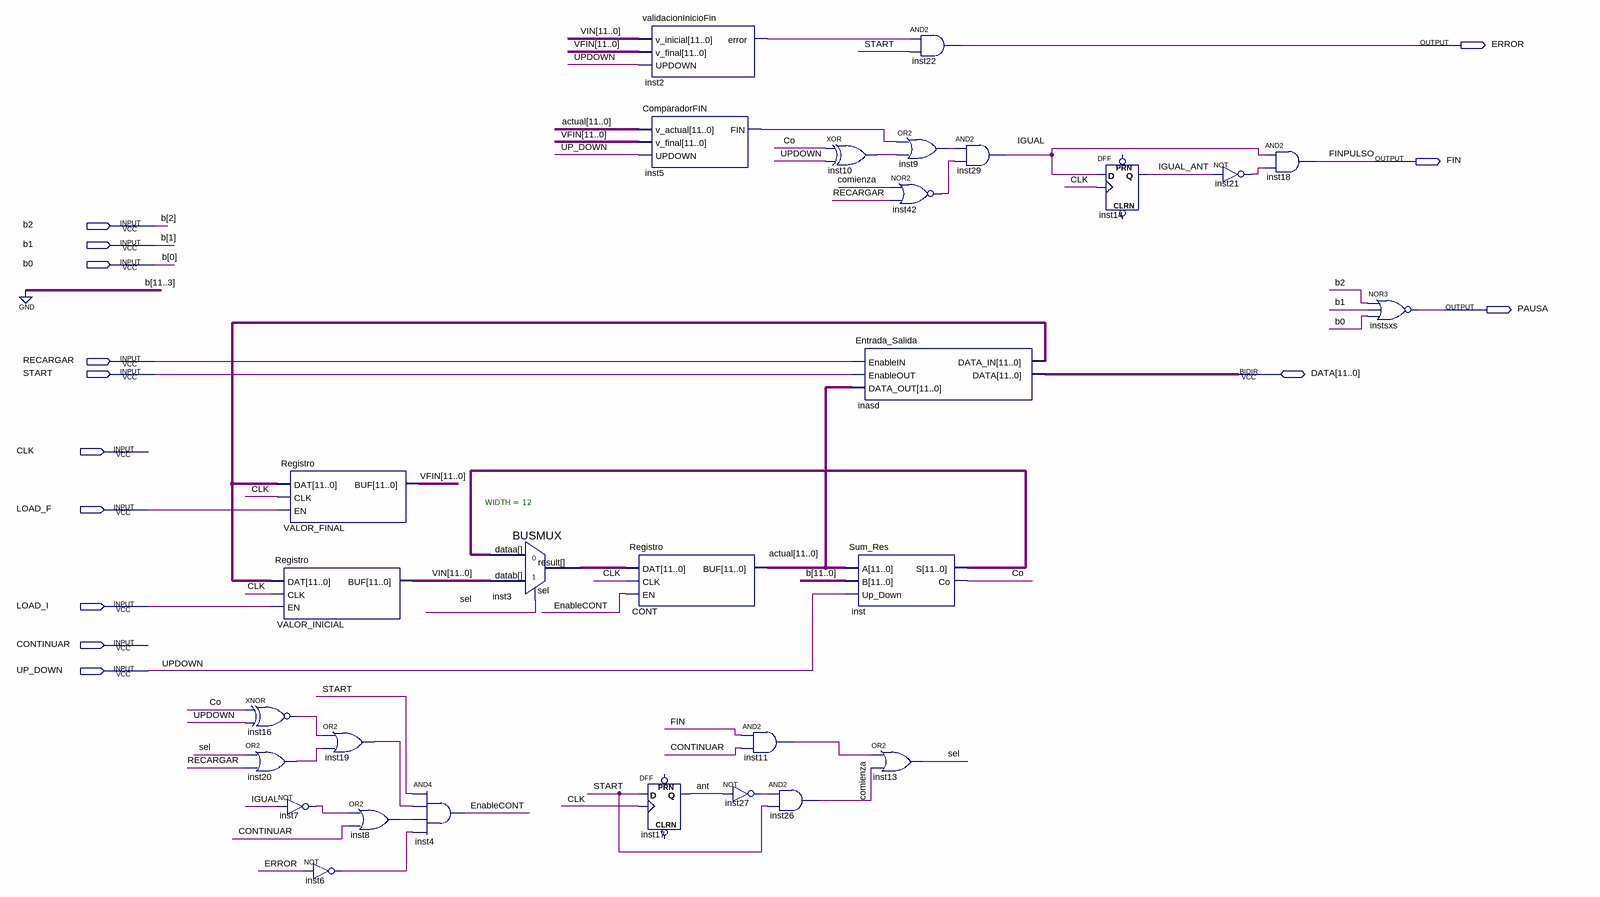
[diagram p0: schematic sheet]
// Quartus schematic CONTADOR_UPDOWN.bdf as structural Verilog: 29 symbols, 14 pins
module CONTADOR_UPDOWN (
  input  b2,
  input  b1,
  input  b0,
  input  RECARGAR,
  input  START,
  input  CLK,
  input  LOAD_F,
  input  LOAD_I,
  input  CONTINUAR,
  input  UP_DOWN,
  inout  [11:0] DATA,
  output ERROR,
  output FIN,
  output PAUSA
);

  wire ant, Co, comienza, EnableCONT, IGUAL, IGUAL_ANT, inst2_error, inst5_fin, inst6_out, inst7_out,
       inst8_out, inst9_out, inst10_out, inst11_out, inst16_out, inst19_out, inst20_out, inst21_out,
       inst27_out, inst42_out, sel;
  wire [11:0] actual, inasd_data_in, inst3_result, inst_s, VFIN, VIN;

  Registro VALOR_FINAL (.DAT(inasd_data_in), .CLK(CLK), .EN(LOAD_F), .BUF(VFIN));
  Registro VALOR_INICIAL (.DAT(inasd_data_in), .CLK(CLK), .EN(LOAD_I), .BUF(VIN));
  xnor inst16 (inst16_out, Co, UP_DOWN);
  or inst20 (inst20_out, sel, RECARGAR);
  not inst7 (inst7_out, IGUAL);
  or inst19 (inst19_out, inst16_out, inst20_out);
  not inst6 (inst6_out, ERROR);
  or inst8 (inst8_out, inst7_out, CONTINUAR);
  and inst4 (EnableCONT, START, inst19_out, inst8_out, inst6_out);
  BUSMUX #(.WIDTH(12)) inst3 (.datab(VIN), .sel(sel), .dataa(inst_s), .result(inst3_result));
  validacionInicioFin inst2 (.v_inicial(VIN), .v_final(VFIN), .UPDOWN(UP_DOWN), .error(inst2_error));
  ComparadorFIN inst5 (.v_actual(actual), .v_final(VFIN), .UPDOWN(UP_DOWN), .FIN(inst5_fin));
  Registro CONT (.DAT(inst3_result), .CLK(CLK), .EN(EnableCONT), .BUF(actual));
  DFF inst17 (.CLK(CLK), .D(START), .Q(ant));  // open: CLRN, PRN
  and inst11 (inst11_out, FIN, CONTINUAR);
  not inst27 (inst27_out, ant);
  and inst26 (comienza, inst27_out, START);
  xor inst10 (inst10_out, Co, UP_DOWN);
  Entrada_Salida inasd (
    .EnableIN(RECARGAR), .EnableOUT(START), .DATA_OUT(actual), .DATA_IN(inasd_data_in), .DATA(DATA));
  Sum_Res inst (.A(actual), .B({{9{1'b0}}, b2, b1, b0}), .Up_Down(UP_DOWN), .S(inst_s), .Co(Co));
  and inst22 (ERROR, inst2_error, START);
  or inst9 (inst9_out, inst5_fin, inst10_out);
  nor inst42 (inst42_out, comienza, RECARGAR);
  or inst13 (sel, inst11_out, comienza);
  and inst29 (IGUAL, inst9_out, inst42_out);
  DFF inst14 (.CLK(CLK), .D(IGUAL), .Q(IGUAL_ANT));  // open: CLRN, PRN
  not inst21 (inst21_out, IGUAL_ANT);
  and inst18 (FIN, IGUAL, inst21_out);
  nor instsxs (PAUSA, b2, b1, b0);

  // Other names for the same wires on the sheet: FINPULSO = FIN; UPDOWN = UP_DOWN
endmodule
